# Altium project PCB_Project.PrjPcb
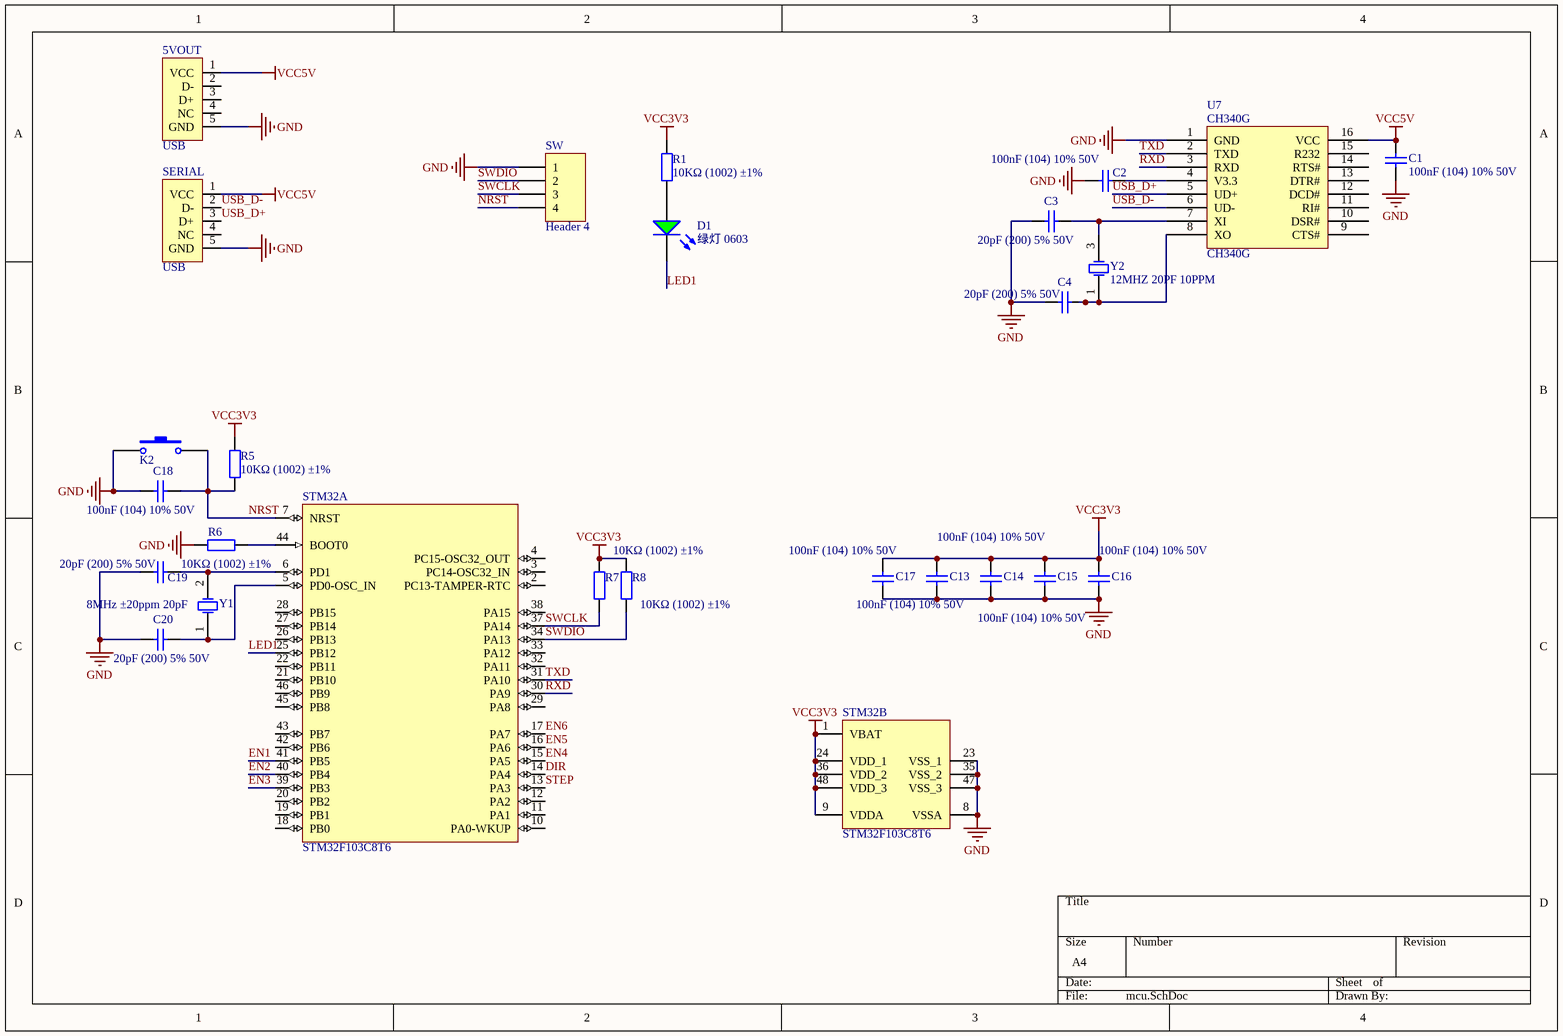
[diagram p0: mcu.SchDoc]
3 sheets, 52 parts. Net scope: global (net labels, ports and power ports of the same name join across sheets).
Board file: mofang.PcbDoc
Sheets:
  mcu.SchDoc
  mofang.SchDoc
  power.SchDoc

## Sheet mcu.SchDoc
size A4

### Parts
5VOUT  USB  [USB_5]
C1  100nF (104) 10% 50V  [0603_C]
C2  100nF (104) 10% 50V  [0603_C]
C3  20pF (200) 5% 50V  [0603_C]
C4  20pF (200) 5% 50V  [0603_C]
C13  100nF (104) 10% 50V  [0603_C]
C14  100nF (104) 10% 50V  [0603_C]
C15  100nF (104) 10% 50V  [0603_C]
C16  100nF (104) 10% 50V  [0603_C]
C17  100nF (104) 10% 50V  [0603_C]
C18  100nF (104) 10% 50V  [0603_C]
C19  20pF (200) 5% 50V  [0603_C]
C20  20pF (200) 5% 50V  [0603_C]
D1  绿灯 0603  [0603_LED_S1]
K2  KEY  [Key_Sop]  (value not drawn)
R1  10KΩ (1002) ±1%  [0603_R]
R5  10KΩ (1002) ±1%  [0603_R]
R6  10KΩ (1002) ±1%  [0603_R]
R7  10KΩ (1002) ±1%  [0603_R]
R8  10KΩ (1002) ±1%  [0603_R]
SERIAL  USB  [USB_5]
STM32  STM32F103C8T6  [LQFP-48_7x7x05P]  (parts A,B of 2)
SW  Header 4  [HDR1X4]
U7  CH340G  [SOIC-16_150mil]
Y1  8MHz ±20ppm 20pF  [SMD-5032_2P]
Y2  12MHZ 20PF 10PPM  [SMD-3225_4P]

### Nets
GND: 5VOUT.5(GND) C1.1 C2.1 C3.2 C4.2 C13.1 C14.1 C15.1 C16.1 C17.1 C18.2 C19.1 C20.1 K2.1 R6.2 SERIAL.5(GND) STM32.8(VSSA) STM32.23(VSS_1) STM32.35(VSS_2) STM32.47(VSS_3) SW.1 U7.1(GND)
VCC3V3: C13.2 C14.2 C15.2 C16.2 C17.2 R1.1 R5.2 R7.2 R8.2 STM32.1(VBAT) STM32.9(VDDA) STM32.24(VDD_1) STM32.36(VDD_2) STM32.48(VDD_3)
VCC5V: 5VOUT.1(VCC) C1.2 SERIAL.1(VCC) U7.16(VCC)
DIR: STM32.14(PA4)
EN1: STM32.41(PB5)
EN2: STM32.40(PB4)
EN3: STM32.39(PB3)
EN4: STM32.15(PA5)
EN5: STM32.16(PA6)
EN6: STM32.17(PA7)
LED1: D1.K STM32.25(PB12)
NRST: C18.1 K2.2 R5.1 STM32.7(NRST) SW.4
RXD: STM32.30(PA9) U7.3(RXD)
STEP: STM32.13(PA3)
SWCLK: R7.1 STM32.37(PA14) SW.3
SWDIO: R8.1 STM32.34(PA13) SW.2
TXD: STM32.31(PA10) U7.2(TXD)
USB_D+: SERIAL.3(D+) U7.5(UD+)
USB_D-: SERIAL.2(D-) U7.6(UD-)
NetC2_2: C2.2 U7.4(V3.3)
NetC3_1: C3.1 U7.7(XI) Y2.3(OSC2)
NetC4_1: C4.1 U7.8(XO) Y2.1(OSC1)
NetC19_2: C19.2 STM32.6(PD1) Y1.2(OSC2)
NetC20_2: C20.2 STM32.5(PD0-OSC_IN) Y1.1(OSC1)
NetD1_A: D1.A R1.2
NetR6_1: R6.1 STM32.44(BOOT0)

Not connected (* = marked no-connect by the designer): 5VOUT 2(D-) 3(D+) 4(NC); SERIAL 4(NC); STM32 2(PC13-TAMPER-RTC) 3(PC14-OSC32_IN) 4(PC15-OSC32_OUT) 10(PA0-WKUP) 11(PA1) 12(PA2) 18(PB0) 19(PB1) 20(PB2) 21(PB10) 22(PB11) 26(PB13) 27(PB14) 28(PB15) 29(PA8) 32(PA11) 33(PA12) 38(PA15) 42(PB6) 43(PB7) 45(PB8) 46(PB9); U7 9(CTS#) 10(DSR#) 11(RI#) 12(DCD#) 13(DTR#) 14(RTS#) 15(R232)

### Library data of the parts
5VOUT SERIAL = USB_2
C1 C2 C13-C18 = 0603 100nF (104) 10% 50V: 贴片电容; ComponentLink1Description: 供应商链接; ComponentLink1URL: http://www.szlcsc.com/product/details_15331.html; Package: 0603; Supplier: LC; SuppliersPartNumber: C14663
C3 C4 C19 C20 = 0603 20pF (200) 5% 50V: 贴片电容; ComponentLink1Description: 供应商链接; ComponentLink1URL: http://www.szlcsc.com/product/details_2000.html; Package: 0603; Supplier: LC; SuppliersPartNumber: C1648
D1 = 0603 绿灯: 发光二极管; ComponentLink1Description: 供应商链接; ComponentLink1URL: http://www.szlcsc.com/product/details_73152.html; Package: 0603; Supplier: LC; SuppliersPartNumber: C72043
K2 = KEY_SOP: 贴片按键
R1 R5-R8 = 0603 10KΩ (1002) 1%: 贴片电阻; ComponentLink1Description: 供应商链接; ComponentLink1URL: http://www.szlcsc.com/product/details_26547.html; Package: 0603; Supplier: LC; SuppliersPartNumber: C25804
STM32 = STM32F103C8T6: ARM; ComponentLink1Description: 供应商链接; ComponentLink1URL: http://www.szlcsc.com/product/details_9243.html; Package: LQFP-48_7x7x05P; Supplier: LC; SuppliersPartNumber: C8734
SW = Header 4: Header, 4-Pin; LatestRevisionDate: 17-Jul-2002; LatestRevisionNote: Re-released for DXP Platform.; Publisher: Altium Limited
U7 = CH340G_[C14267]: USB; ComponentLink1Description: 供应商链接; ComponentLink1URL: http://www.szlcsc.com/product/details_14927.html; Package: SOIC-16_150mil; Supplier: LC; SuppliersPartNumber: C14267
Y1 = SMD-5032_2P 8MHz 20ppm 20pF: 贴片晶振; ComponentLink1Description: 供应商链接; ComponentLink1URL: http://www.szlcsc.com/product/details_117214.html; Package: SMD-5032_2P; Supplier: LC; SuppliersPartNumber: C115962
Y2 = SMD-3225_4P  12MHZ 20PF 10PPM: 贴片晶振; ComponentLink1Description: 供应商链接; ComponentLink1URL: http://www.szlcsc.com/product/details_9522.html; Package: SMD-3225_4P; Supplier: LC; SuppliersPartNumber: C9002

## Sheet mofang.SchDoc
size A4
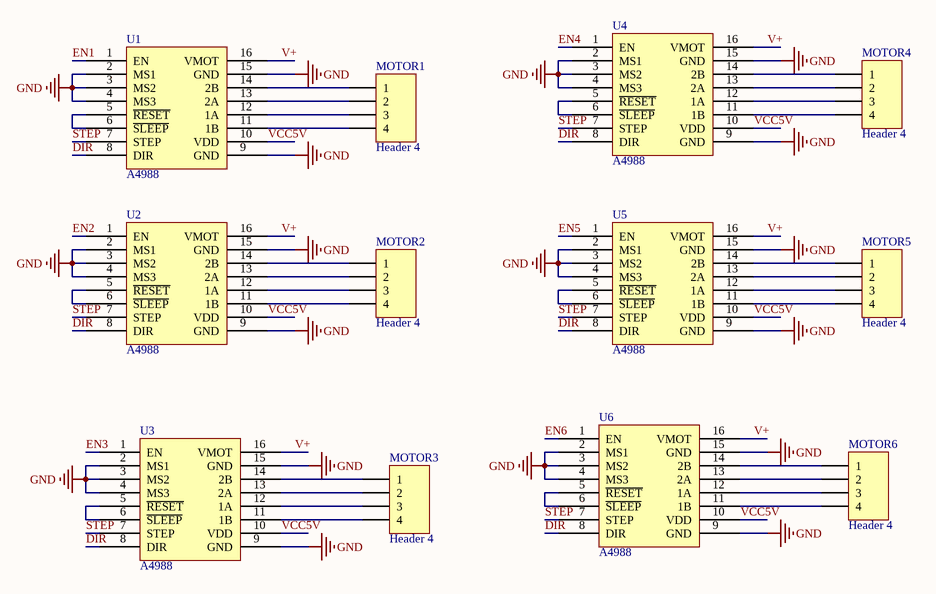
[diagram p1: mofang.SchDoc]

### Parts
MOTOR1  Header 4  [HDR1X4]
MOTOR2  Header 4  [HDR1X4]
MOTOR3  Header 4  [HDR1X4]
MOTOR4  Header 4  [HDR1X4]
MOTOR5  Header 4  [HDR1X4]
MOTOR6  Header 4  [HDR1X4]
U1  A4988  [A4988]
U2  A4988  [A4988]
U3  A4988  [A4988]
U4  A4988  [A4988]
U5  A4988  [A4988]
U6  A4988  [A4988]

### Nets
GND: U1.2(MS1) U1.3(MS2) U1.4(MS3) U1.9(GND) U1.15(GND) U2.2(MS1) U2.3(MS2) U2.4(MS3) U2.9(GND) U2.15(GND) U3.2(MS1) U3.3(MS2) U3.4(MS3) U3.9(GND) U3.15(GND) U4.2(MS1) U4.3(MS2) U4.4(MS3) U4.9(GND) U4.15(GND) U5.2(MS1) U5.3(MS2) U5.4(MS3) U5.9(GND) U5.15(GND) U6.2(MS1) U6.3(MS2) U6.4(MS3) U6.9(GND) U6.15(GND)
V+: U1.16(VMOT) U2.16(VMOT) U3.16(VMOT) U4.16(VMOT) U5.16(VMOT) U6.16(VMOT)
VCC5V: U1.10(VDD) U2.10(VDD) U3.10(VDD) U4.10(VDD) U5.10(VDD) U6.10(VDD)
DIR: U1.8(DIR) U2.8(DIR) U3.8(DIR) U4.8(DIR) U5.8(DIR) U6.8(DIR)
EN1: U1.1(EN)
EN2: U2.1(EN)
EN3: U3.1(EN)
EN4: U4.1(EN)
EN5: U5.1(EN)
EN6: U6.1(EN)
STEP: U1.7(STEP) U2.7(STEP) U3.7(STEP) U4.7(STEP) U5.7(STEP) U6.7(STEP)
NetMOTOR1_1: MOTOR1.1 U1.14(2B)
NetMOTOR1_2: MOTOR1.2 U1.13(2A)
NetMOTOR1_3: MOTOR1.3 U1.12(1A)
NetMOTOR1_4: MOTOR1.4 U1.11(1B)
NetMOTOR2_1: MOTOR2.1 U2.14(2B)
NetMOTOR2_2: MOTOR2.2 U2.13(2A)
NetMOTOR2_3: MOTOR2.3 U2.12(1A)
NetMOTOR2_4: MOTOR2.4 U2.11(1B)
NetMOTOR3_1: MOTOR3.1 U3.14(2B)
NetMOTOR3_2: MOTOR3.2 U3.13(2A)
NetMOTOR3_3: MOTOR3.3 U3.12(1A)
NetMOTOR3_4: MOTOR3.4 U3.11(1B)
NetMOTOR4_1: MOTOR4.1 U4.14(2B)
NetMOTOR4_2: MOTOR4.2 U4.13(2A)
NetMOTOR4_3: MOTOR4.3 U4.12(1A)
NetMOTOR4_4: MOTOR4.4 U4.11(1B)
NetMOTOR5_1: MOTOR5.1 U5.14(2B)
NetMOTOR5_2: MOTOR5.2 U5.13(2A)
NetMOTOR5_3: MOTOR5.3 U5.12(1A)
NetMOTOR5_4: MOTOR5.4 U5.11(1B)
NetMOTOR6_1: MOTOR6.1 U6.14(2B)
NetMOTOR6_2: MOTOR6.2 U6.13(2A)
NetMOTOR6_3: MOTOR6.3 U6.12(1A)
NetMOTOR6_4: MOTOR6.4 U6.11(1B)
NetU1_5: U1.5(~{RESET}) U1.6(~{SLEEP})
NetU2_5: U2.5(~{RESET}) U2.6(~{SLEEP})
NetU3_5: U3.5(~{RESET}) U3.6(~{SLEEP})
NetU4_5: U4.5(~{RESET}) U4.6(~{SLEEP})
NetU5_5: U5.5(~{RESET}) U5.6(~{SLEEP})
NetU6_5: U6.5(~{RESET}) U6.6(~{SLEEP})

### Library data of the parts
MOTOR1-MOTOR6 = Header 4: Header, 4-Pin; LatestRevisionDate: 17-Jul-2002; LatestRevisionNote: Re-released for DXP Platform.; Publisher: Altium Limited

## Sheet power.SchDoc
size A4
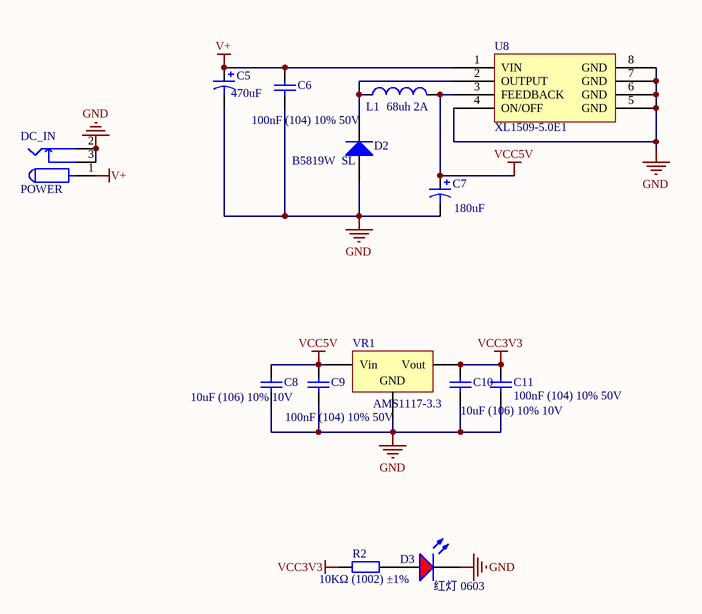
[diagram p2: power.SchDoc]

### Parts
C5  value 470uF  [SMD-EC-F8]  (hidden comment: Cap Pol3)
C6  100nF (104) 10% 50V  [0603_C]
C7  value 180uF  [470UF_A]  (hidden comment: Cap Pol3)
C8  10uF (106) 10% 10V  [0603_C]
C9  100nF (104) 10% 50V  [0603_C]
C10  10uF (106) 10% 10V  [0603_C]
C11  100nF (104) 10% 50V  [0603_C]
D2  B5819W  SL  [SOD-123]
D3  红灯 0603  [0603_LED_S1]
DC_IN  POWER  [DC10B]
L1  68uh 2A  [0630]
R2  10KΩ (1002) ±1%  [0603_R]
U8  XL1509-5.0E1  [SOP-8_150mil]
VR1  AMS1117-3.3  [SOT-223]

### Nets
GND: C5.2 C6.1 C7.2 C8.1 C9.1 C10.1 C11.1 D2.1(A) D3.K DC_IN.2 DC_IN.3 U8.4(ON/OFF) U8.5(GND) U8.6(GND) U8.7(GND) U8.8(GND) VR1.1(GND)
V+: C5.1 C6.2 DC_IN.1 U8.1(VIN)
VCC3V3: C10.2 C11.2 R2.1 VR1.2(Vout)
VCC5V: C7.1 C8.2 C9.2 L1.2 U8.3(FEEDBACK) VR1.3(Vin)
NetD2_2: D2.2(K) L1.1 U8.2(OUTPUT)
NetD3_A: D3.A R2.2

### Library data of the parts
C5 C7 = Cap Pol3: Polarized Capacitor (Surface Mount); Published: 8-Jun-2000; LatestRevisionDate: 29-May-2009; LatestRevisionNote: IPC-7351 Footprint Added.; PackageReference: C0805; Publisher: Altium Limited; PackageDescription: Chip Capacitor
C6 C9 C11 = 0603 100nF (104) 10% 50V: 贴片电容; ComponentLink1Description: 供应商链接; ComponentLink1URL: http://www.szlcsc.com/product/details_15331.html; Package: 0603; Supplier: LC; SuppliersPartNumber: C14663
C8 C10 = 0603 10uF (106) 10% 10V: 贴片电容; ComponentLink1Description: 供应商链接; ComponentLink1URL: http://www.szlcsc.com/product/details_20411.html; Package: 0603; Supplier: LC; SuppliersPartNumber: C19702
D2 = SOD-123 B5819W  SL: 肖特基二极管; ComponentLink1Description: 供应商链接; ComponentLink1URL: http://www.szlcsc.com/product/details_9093.html; Package: SOD-123; Supplier: LC; SuppliersPartNumber: C8598
D3 = 0603 红灯: 发光二极管; ComponentLink1Description: 供应商链接; ComponentLink1URL: http://www.szlcsc.com/product/details_2659.html; Package: 0603; Supplier: LC; SuppliersPartNumber: C2286
DC_IN = POW
L1 = Inductor: Code_IEC: 1005; Published: 8-Jun-2000; LatestRevisionDate: 17-Jul-2002; LatestRevisionNote: Re-released for DXP Platform.; PackageReference: 0402-A; Publisher: Altium Limited; Code_JEITA: 0402; Value: 68uh
R2 = 0603 10KΩ (1002) 1%: 贴片电阻; ComponentLink1Description: 供应商链接; ComponentLink1URL: http://www.szlcsc.com/product/details_26547.html; Package: 0603; Supplier: LC; SuppliersPartNumber: C25804
U8 = XL1509-5.0E1_[C61063]: DC-DC芯片; ComponentLink1Description: 供应商链接; ComponentLink1URL: http://www.szlcsc.com/product/details_62115.html; Package: SOP-8_150mil; Supplier: LC; SuppliersPartNumber: C61063
VR1 = SOT-223 AMS1117-3.3: 低压差线性稳压(LDO); ComponentLink1Description: 供应商链接; ComponentLink1URL: http://www.szlcsc.com/product/details_6652.html; Package: SOT-223; Supplier: LC; SuppliersPartNumber: C6186

## Nets that join several sheets
GND: mcu (22 pins), mofang (30 pins), power (17 pins)
V+: mofang (6 pins), power (C5.1 C6.2 DC_IN.1 U8.1)
VCC3V3: mcu (14 pins), power (C10.2 C11.2 R2.1 VR1.2)
VCC5V: mcu (5VOUT.1 C1.2 SERIAL.1 U7.16), mofang (6 pins), power (6 pins)
DIR: mcu (STM32.14), mofang (6 pins)
EN1: mcu (STM32.41), mofang (U1.1)
EN2: mcu (STM32.40), mofang (U2.1)
EN3: mcu (STM32.39), mofang (U3.1)
EN4: mcu (STM32.15), mofang (U4.1)
EN5: mcu (STM32.16), mofang (U5.1)
EN6: mcu (STM32.17), mofang (U6.1)
STEP: mcu (STM32.13), mofang (6 pins)